# EAGLE schematic LoRa (EAGLE 8.6.1)

## Sheet 1 of 2: Power
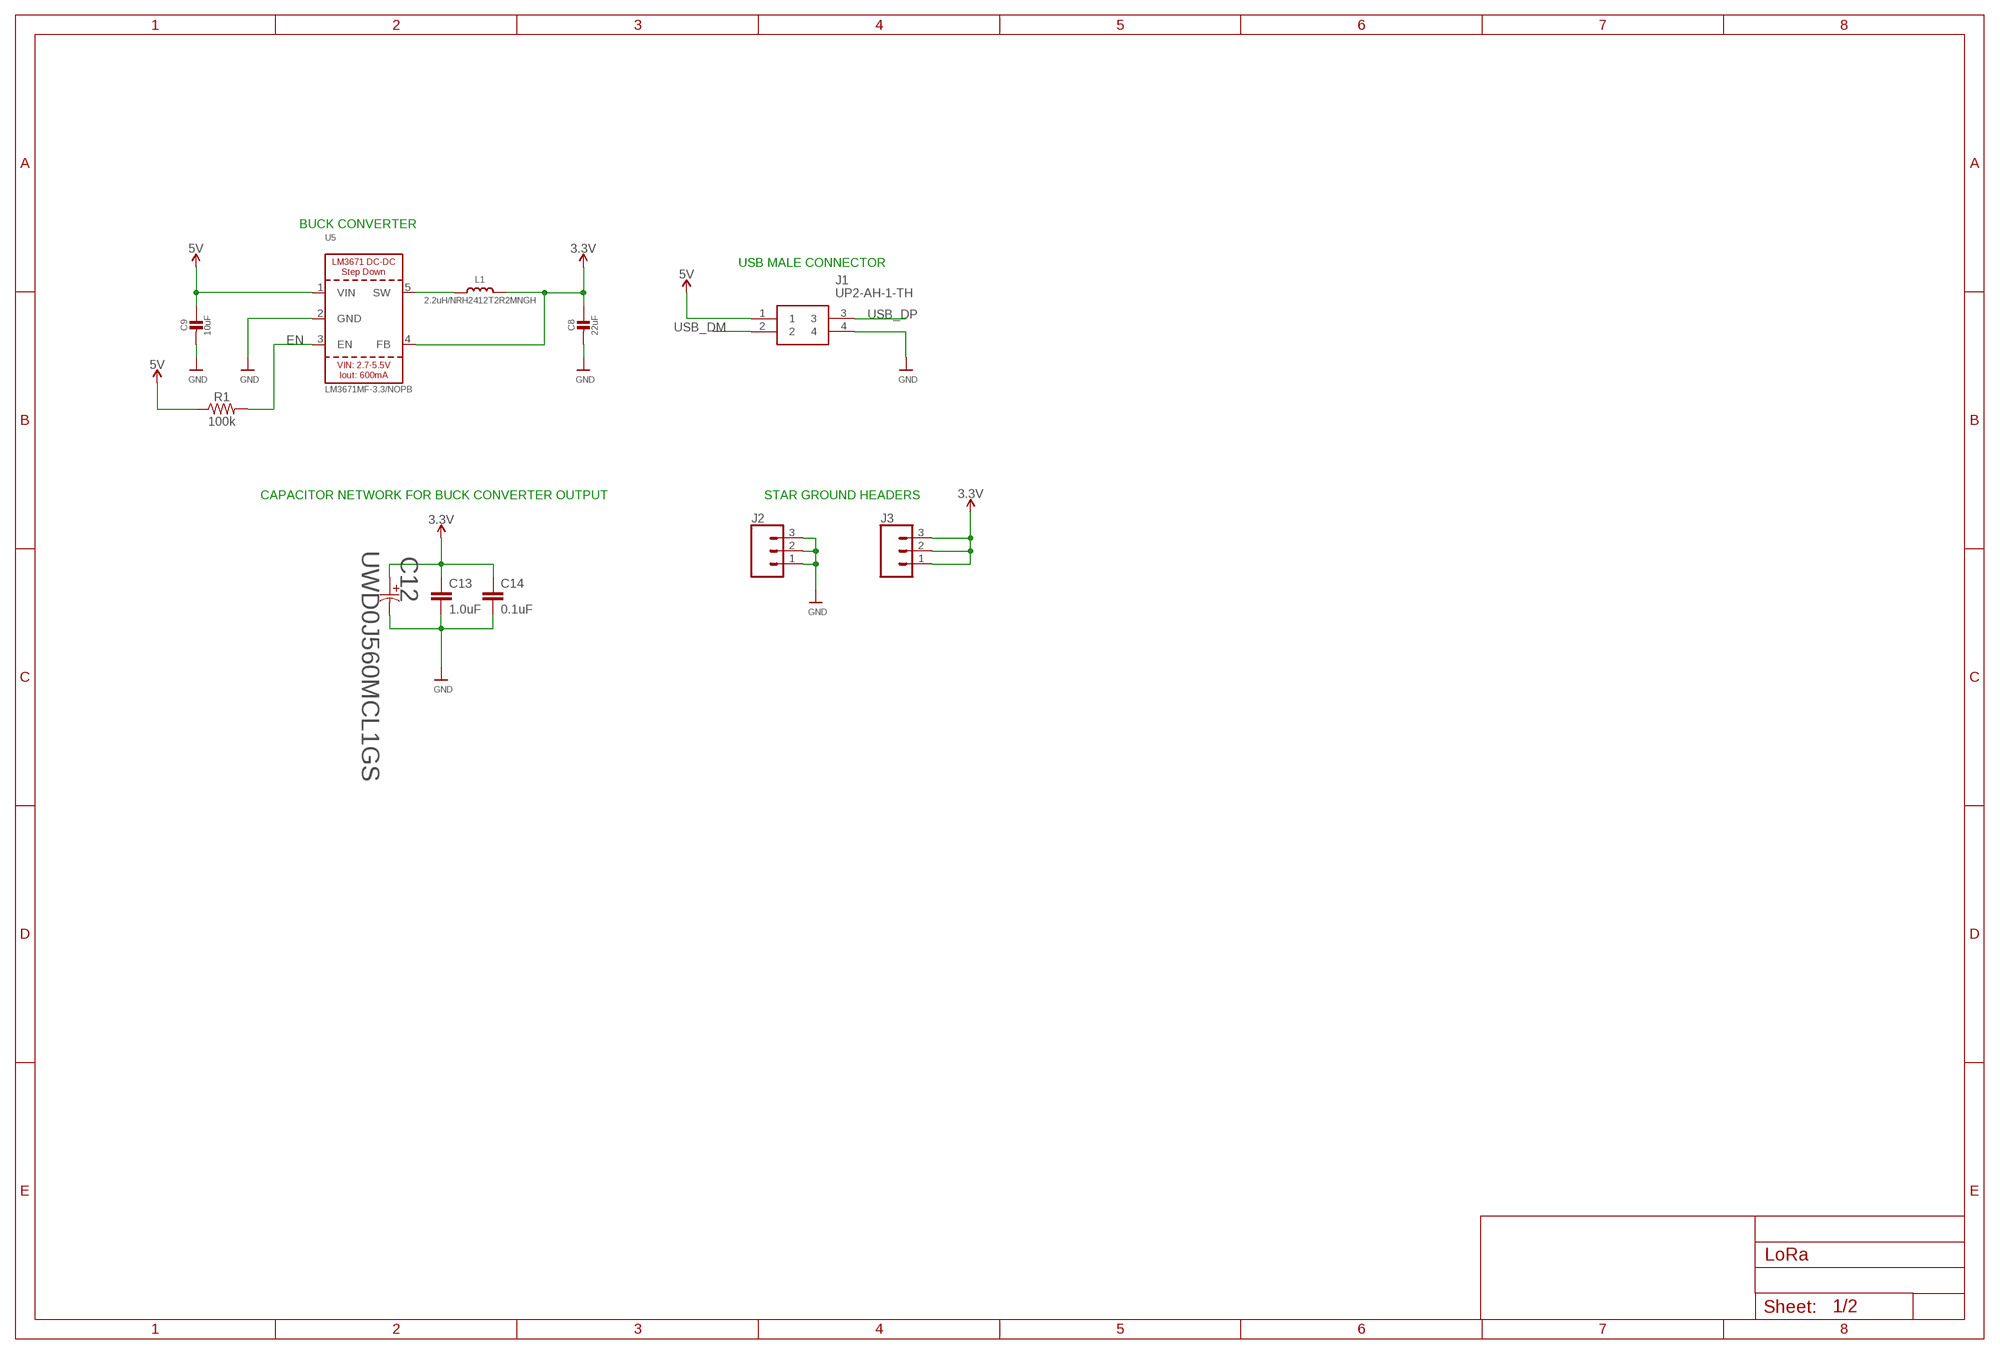
[diagram p0: schematic, sheet 1]

### Parts
C8  22uF  CAP_CERAMIC0805-NOOUTLINE  [0805-NO]
C9  10uF  CAP_CERAMIC0805-NOOUTLINE  [0805-NO]
C12  UWD0J560MCL1GS  [PCAP_5X5.8-ELECT]
C13  1.0uF  1.0UF-0603-16V-10%  [0603]
C14  0.1uF  0.1UF-0603-25V-(+80/-20%)  [0603]
J1  UP2-AH-1-TH  [UP2-AH-1-TH]
J2  CONN_03  [1X03]
J3  CONN_03  [1X03]
L1  2.2uH/NRH2412T2R2MNGH  INDUCTORNRH2412T  [INDUCTOR_TAIYOYUDEN_NRH2412T]
R1  100k  100KOHM-0603-1/10W-1%  [0603]
U5  LM3671MF-3.3/NOPB  VREG_LM3671  [SOT23-5]

### Nets
3.3V: C8.1 C12.1 C13.1 C14.1 J3.1 J3.2 J3.3 L1.2 U5.4(FB) ; also sheet 2
5V: C9.1 J1.1 R1.1 U5.1(VIN)
EN: R1.2 U5.3(EN)
GND: C8.2 C9.2 C12.2 C13.2 C14.2 J1.4 J2.1 J2.2 J2.3 U5.2(GND) ; also sheet 2
N$2: L1.1 U5.5(SW)
USB_DM: J1.2 ; also sheet 2
USB_DP: J1.3 ; also sheet 2

### Notes on the sheet
- BUCK CONVERTER
- USB MALE CONNECTOR
- CAPACITOR NETWORK FOR BUCK CONVERTER OUTPUT | STAR GROUND HEADERS

## Sheet 2 of 2: Microcontroller and LoRa
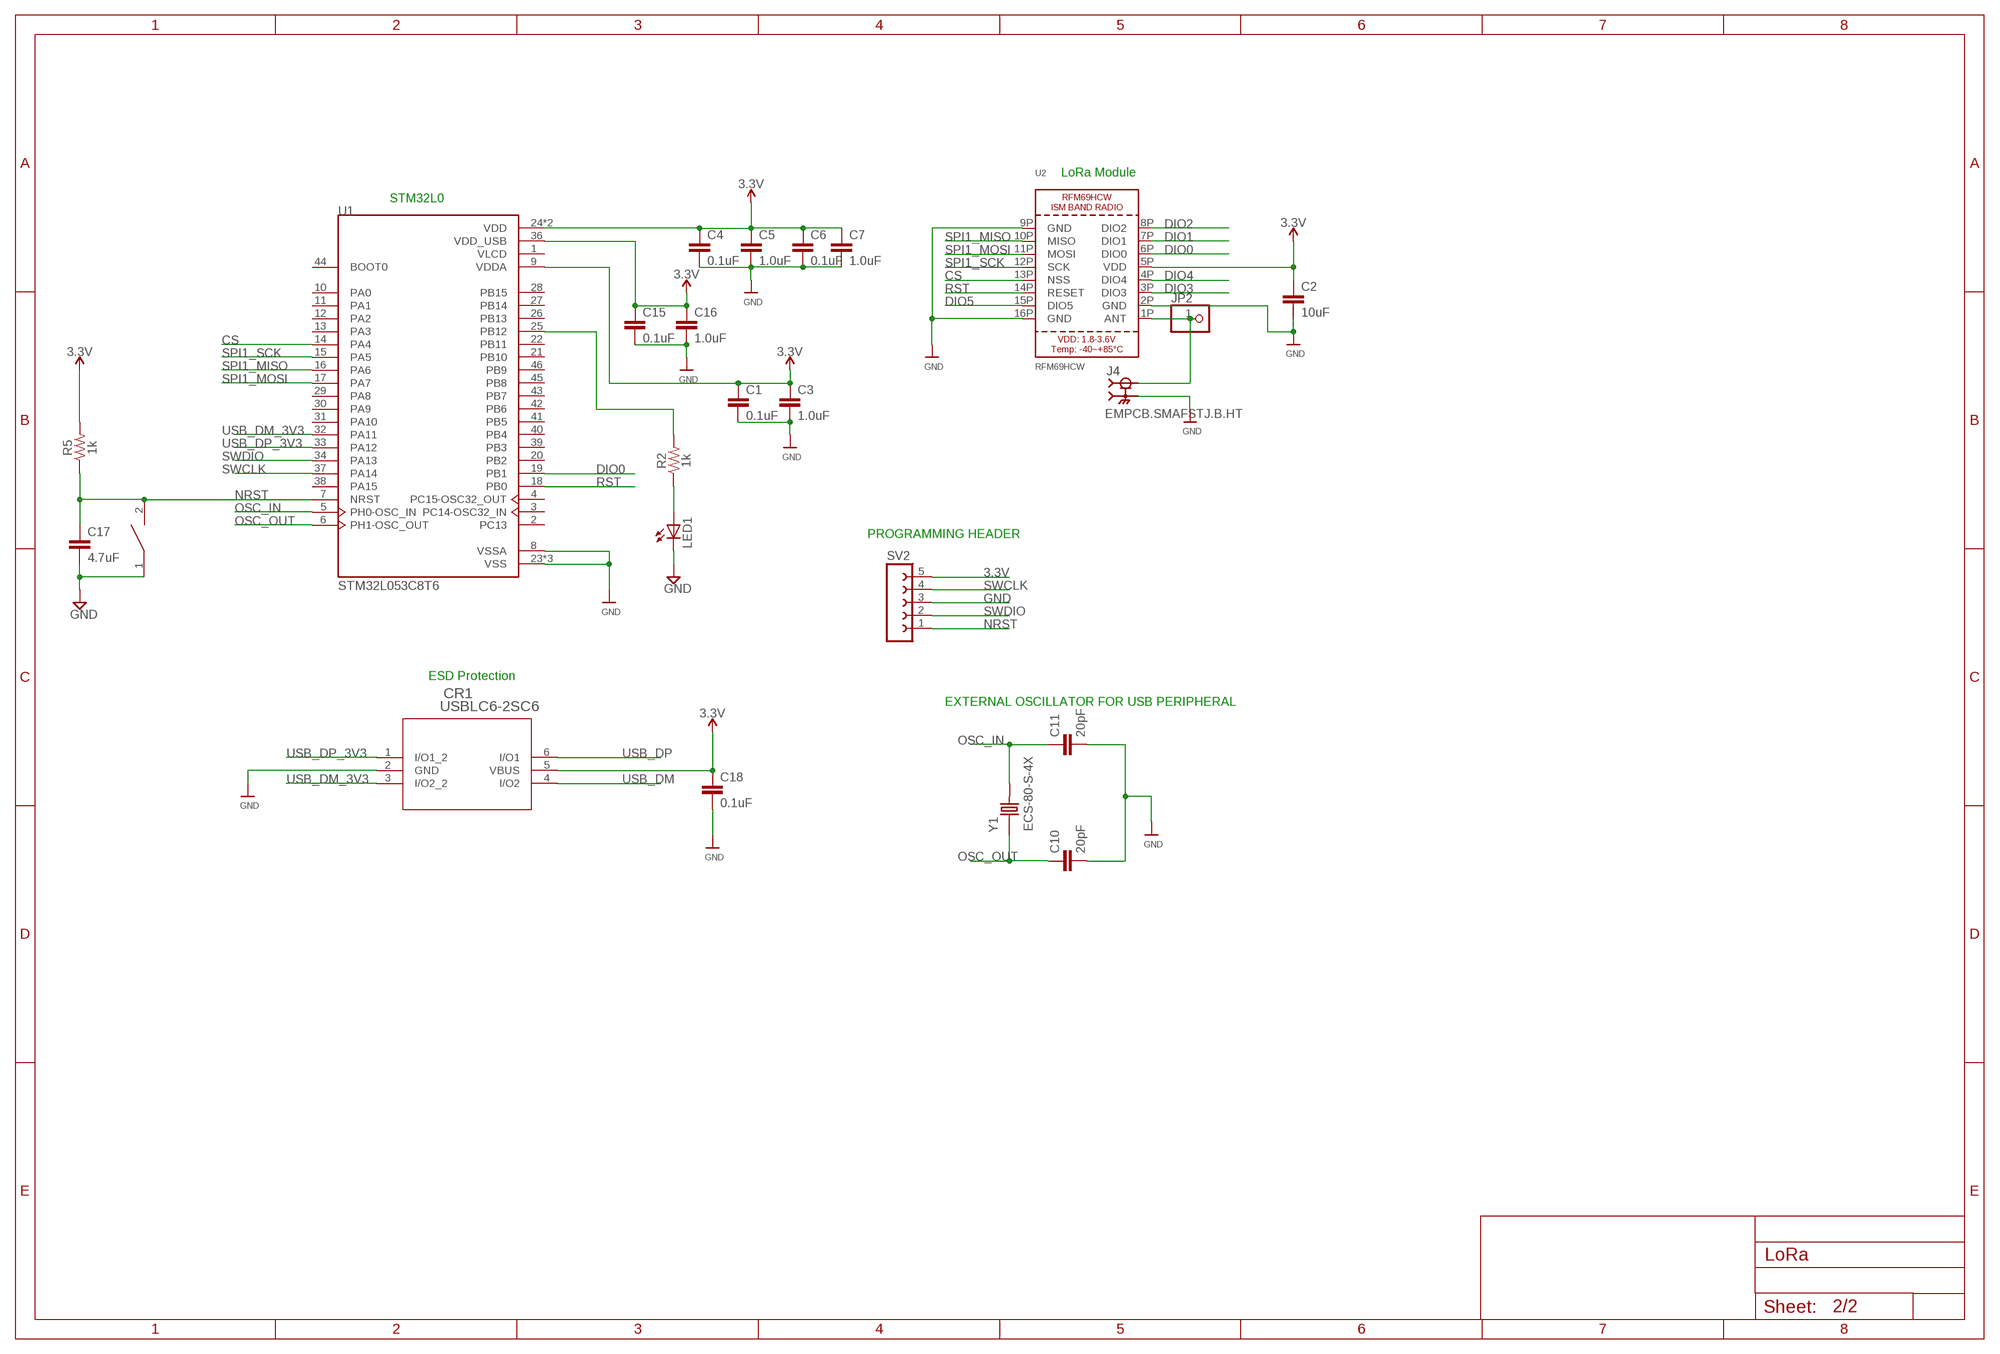
[diagram p1: schematic, sheet 2]

### Parts
C1  0.1uF  0.1UF-0603-25V-(+80/-20%)  [0603]
C2  10uF  10UF-0603-6.3V-20%  [0603]
C3  1.0uF  1.0UF-0603-16V-10%  [0603]
C4  0.1uF  0.1UF-0603-25V-(+80/-20%)  [0603]
C5  1.0uF  1.0UF-0603-16V-10%  [0603]
C6  0.1uF  0.1UF-0603-25V-(+80/-20%)  [0603]
C7  1.0uF  1.0UF-0603-16V-10%  [0603]
C10  20pF  4.7UF0603  [0603]
C11  20pF  4.7UF0603  [0603]
C15  0.1uF  0.1UF-0603-25V-(+80/-20%)  [0603]
C16  1.0uF  1.0UF-0603-16V-10%  [0603]
C17  4.7uF  4.7UF0603  [0603]
C18  0.1uF  0.1UF-0603-25V-(+80/-20%)  [0603]
CR1  USBLC6-2SC6  [SOT23-6L]
J4  EMPCB.SMAFSTJ.B.HT  [TAOGLAS_EMPCB.SMAFSTJ.B.HT]
JP2  HEADER-1X1ROUND  [1X01_ROUND]
LED1  LEDCHIP-LED0805  [CHIP-LED0805]
R2  1k  1KOHM-0603-1/10W-1%  [0603]
R5  1k  1KOHM-0603-1/10W-1%  [0603]
RESET  SWITCH  [SW_2512]
SV2  FE05-1  [FE05-1]
U1  STM32L053C8T6  [QFP50P900X900X160-48N]
U2  RFM69HCW  RFM69HCW_SMT  [RFMHCW_SMT]
Y1  ECS-80-S-4X  [XTAL_ECS-80-S-4X]

### Nets
3.3V: C1.1 C2.1 C3.1 C4.1 C5.1 C6.1 C7.1 C15.1 C16.1 C18.1 CR1.5(VBUS) R5.2 SV2.5 U1.9(VDDA) U1.24(VDD) U1.36(VDD_USB) U1.48(VDD) U2.5P(VDD) ; also sheet 1
CS: U1.14(PA4) U2.13P(NSS)
DIO0: U1.19(PB1) U2.6P(DIO0)
DIO1: U2.7P(DIO1)
DIO2: U2.8P(DIO2)
DIO3: U2.3P(DIO3)
DIO4: U2.4P(DIO4)
DIO5: U2.15P(DIO5)
GND: C1.2 C2.2 C3.2 C4.2 C5.2 C6.2 C7.2 C10.2 C11.2 C15.2 C16.2 C17.2 C18.2 CR1.2(GND) J4.SH1 J4.SH2 J4.SH3 J4.SH4 LED1.C RESET.1 SV2.3 U1.8(VSSA) U1.23(VSS) U1.35(VSS) U1.47(VSS) U2.2P(GND) U2.9P(GND) U2.16P(GND) ; also sheet 1
N$1: J4.1 JP2.1 U2.1P(ANT)
N$3: R2.2 U1.25(PB12)
N$4: LED1.A R2.1
NRST: C17.1 R5.1 RESET.2 SV2.1 U1.7(NRST)
OSC_IN: C11.1 U1.5(PH0-OSC_IN) Y1.2
OSC_OUT: C10.1 U1.6(PH1-OSC_OUT) Y1.1
RST: U1.18(PB0) U2.14P(RESET)
SPI1_MISO: U1.16(PA6) U2.10P(MISO)
SPI1_MOSI: U1.17(PA7) U2.11P(MOSI)
SPI1_SCK: U1.15(PA5) U2.12P(SCK)
SWCLK: SV2.4 U1.37(PA14)
SWDIO: SV2.2 U1.34(PA13)
USB_DM: CR1.4(I/O2) ; also sheet 1
USB_DM_3V3: CR1.3(I/O2_2) U1.32(PA11)
USB_DP: CR1.6(I/O1) ; also sheet 1
USB_DP_3V3: CR1.1(I/O1_2) U1.33(PA12)
Unconnected: U1.1(VLCD) U1.2(PC13) U1.3(PC14-OSC32_IN) U1.4(PC15-OSC32_OUT) U1.10(PA0) U1.11(PA1) U1.12(PA2) U1.13(PA3) U1.20(PB2) U1.21(PB10) U1.22(PB11) U1.26(PB13) U1.27(PB14) U1.28(PB15) U1.29(PA8) U1.30(PA9) U1.31(PA10) U1.38(PA15) U1.39(PB3) U1.40(PB4) U1.41(PB5) U1.42(PB6) U1.43(PB7) U1.44(BOOT0) U1.45(PB8) U1.46(PB9)

### Notes on the sheet
- LoRa Module
- STM32L0
- PROGRAMMING HEADER
- ESD Protection
- EXTERNAL OSCILLATOR FOR USB PERIPHERAL

## Library data of the parts
C1 C4 C6 C14 C15 C18 = SparkFun-Capacitors:0.1UF: 0.1µF ceramic capacitors A capacitor is a passive two-terminal electrical component used to store electrical energy temporarily in an electric field.; PROD_ID: CAP-00810
C2 = SparkFun-Capacitors:10UF: 10.0µF ceramic capacitors A capacitor is a passive two-terminal electrical component used to store electrical energy temporarily in an electric field.; PROD_ID: CAP-11015
C3 C5 C7 C13 C16 = SparkFun-Capacitors:1.0UF: 1µF ceramic capacitors A capacitor is a passive two-terminal electrical component used to store electrical energy temporarily in an electric field.; PROD_ID: CAP-00868
C8 C9 = microbuilder:CAP_CERAMIC: Ceramic Capacitors For new designs, use the packages preceded by an '_' character since they are more reliable: The following footprints should be used on most boards: _0402 - Standard footprint for regular board layouts _0603 - Standard footprint for regular board layouts _0805 - Standard footprint for regular board layouts _1206 - Standard footprint for regular board layouts For extremely tight-pitch boards where space is at a premium, the following 'micro-pitch' footprints can be used (smaller pads, no silkscreen outline, etc.): _0402MP - Micro-pitch footprint for very dense/compact boards _0603MP - Micro-pitch footprint for very dense/compact boards _0805MP - Micro-pitch footprint for very dense/compact boards _1206MP - Micro-pitch footprint for very dense/compact boards
C10 C11 = SparkFun-Capacitors:4.7UF: 4.7µF ceramic capacitors A capacitor is a passive two-terminal electrical component used to store electrical energy temporarily in an electric field.; PROD_ID: CAP-08280; VALUE: 4.7uF
C12 = 56uF_Cap_6.3v:UWD0J560MCL1GS; BUILT_BY: EMA_UL_Team; MANUFACTURER_PART_NUMBER: UWD0J560MCL1GS; VENDOR: Nichicon
C17 = SparkFun-Capacitors:4.7UF: 4.7µF ceramic capacitors A capacitor is a passive two-terminal electrical component used to store electrical energy temporarily in an electric field.; PROD_ID: CAP-08280
CR1 = ESD_Protection:USBLC6-2SC6; BUILT_BY: EMA_UL_Team; MANUFACTURER_PART_NUMBER: USBLC6-2SC6; VENDOR: STMicroelectronics
J1 = USB_Con:UP2-AH-1-TH: USB Connectors USB 2.0 type A plug 4 pin Horizontal TH Source: Datasheet <http://www.cui.com/product/resource/up2-ah-th.pdf>; DESCRIPTION: USB Connectors USB 2.0 type A plug 4 pin Horizontal TH; HEIGHT: mm; MANUFACTURER_NAME: CUI; MANUFACTURER_PART_NUMBER: UP2-AH-1-TH; MOUSER_PART_NUMBER: 490-UP2-AH-1-TH; MOUSER_PRICE-STOCK: https://www.mouser.com/Search/Refine.aspx?Keyword=490-UP2-AH-1-TH
J2 J3 = SparkFun-Connectors:CONN_03: Multi connection point. Often used as Generic Header-pin footprint for 0.1 inch spaced/style header connections On any of the 0.1 inch spaced packages, you can populate with these: Break Away Headers - Straight <https://www.sparkfun.com/products/116> (PRT-00116) Break Away Male Headers - Right Angle <https://www.sparkfun.com/products/553> (PRT-00553) Female Headers <https://www.sparkfun.com/products/115> (PRT-00115) Break Away Headers - Machine Pin <https://www.sparkfun.com/products/117> (PRT-00117) Break Away Female Headers - Swiss Machine Pin <https://www.sparkfun.com/products/743> (PRT-00743) Stackable Header - 3 Pin (Female, 0.1") <https://www.sparkfun.com/products/13875> (PRT-13875) For SCREWTERMINALS and SPRING TERMINALS visit here: Screw Terimnals on SparkFun.com <https://www.sparkfun.com/search/results?term=Screw+Terminals> (5mm/3.5mm/2.54mm spacing) This device is also useful as a general connection point to wire up your design to another part of your project. Our various solder wires solder well into these plated through hole pads. Hook-Up Wire - Assortment (Stranded, 22 AWG) <https://www.sparkfun.com/products/11375> (PRT-11375) Hook-Up Wire - Assortment (Solid Core, 22 AWG) <https://www.sparkfun.com/products/11367> (PRT-11367) View the entire wire category on our website here <https://www.sparkfun.com/categories/141> Special notes: Molex polarized connector foot print use with SKU : PRT-08232 with associated crimp pins and housings.
J4 = EMPCB.SMAFSTJ.B.HT:EMPCB.SMAFSTJ.B.HT: Conn SMA F 0Hz to 12.4GHz 50Ohm Solder ST Edge Mount Gold; DESCRIPTION: SMA Connector Jack, Female Socket 50Ohm Board Edge, End Launch Solder; DIGI-KEY_PART_NUMBER: 931-1175-ND; DIGI-KEY_PURCHASE_URL: https://www.digikey.com/product-detail/en/taoglas-limited/EMPCB.SMAFSTJ.B.HT/931-1175-ND/3522337?utm_source=snapeda&utm_medium=aggregator&utm_campaign=symbol; MF: Taoglas Limited; MP: EMPCB.SMAFSTJ.B.HT; PACKAGE: None
JP2 = microbuilder:HEADER-1X1: PIN HEADER
L1 = microbuilder:INDUCTOR: Inductors 0603: 10nH Ceramic Inductor - microwire antenna/RF (Digikey: 712-1434-2-ND) 0805: 560nH Ceramic Inductor - RF (Digikey: 553-1047-1-ND) 270nH Ceramic Inductor - Q = 40@250MHz, +-5%, 1 Ohm DC Resistance (Digikey: 535-10506-2-ND) 1007 (2518 Metric) SMT: 10µH 10% 250mOhm 820mA 1007 Inductor (Digikey: 587-2189-1-ND) 22µH 10% 500mOhm 580mA 1007 Inductor (Digikey: 587-2190-1-ND) 47µH 10% 950mOhm 420mA 1007 Inductor (Digikey: 587-2191-1-ND) 47µH 5% 100mOhm 1A 1008 Inductor (Digikey: 732-1816-1-ND) 5.0x5.0mm (Taiyo Yuden NR5040 Series) 6.8µH 20% 2.3A 64mOhm Inductor (Digikey: 587-2374-2-ND) 5.0x5.0mm (TDK VLC5045 Series) 4.7µH 20% 3.3A 34mOhm Inductor (Digikey: 445-6526-1-ND) 6.8µH 20% 2.7A 46mOhm Inductor (Digikey: 445-6527-1-ND) 6.0x6.0mm (TDK VLC6045 Series) 4.7µH 20% 3.8A 27mOhm Inductor (Digikey: 445-6538-2-ND) 6.8µH 20% 3A 41mOhm Inductor (Digikey: 445-6540-1-ND) 6.2µH 30% 2.2A 45mOhm Inductor (Digikey: SRR5028-6R2YCT-ND) - Not TDK VLC6045 but footprint should match 6.0x6.0mm (TDK SLF6045 Series) 6.8uH 30% 2A 33mOhm Inductor (Digikey: 445-4572-1-ND, Mouser: 810-SLF645T6R8N2R0PF) 6.0x6.0mm (Sumida CDRH5D28 Series) 6.2uH 30% 1.8A 45mOhm Inductor (Digikey: 308-1542-1-ND) Taiyo Yuden NR3015T2R2M - 2.2uH 20% 1.5A (Digikey: 587-1648-2-ND, Mouser: 963-NR3015T2R2M) - Used with TI TPS62172 CoilCraft RFID Transponder Coil - MA5532-AE (For use with AS3935 Lightning Sensor) Taiyo Yuden NRH2412T2R2MNGH - 2.2uH 20% 1AA (Digikey: 587-3443-1-ND) - Used with TI LM3671 Vishay IHLP 1.0uH Molded Inductor - 24mOhm DCR, 5A, +/-20%, -55°C-125°C (Digikey: 541-1319-1-ND)
LED1 = led:LED: LED OSRAM: - CHIPLED LG R971, LG N971, LY N971, LG Q971, LY Q971, LO R971, LY R971 LH N974, LH R974 LS Q976, LO Q976, LY Q976 LO Q996 - Hyper CHIPLED LW Q18S LB Q993, LB Q99A, LB R99A - SideLED LS A670, LO A670, LY A670, LG A670, LP A670 LB A673, LV A673, LT A673, LW A673 LH A674 LY A675 LS A676, LA A676, LO A676, LY A676, LW A676 LS A679, LY A679, LG A679 - Hyper Micro SIDELED® LS Y876, LA Y876, LO Y876, LY Y876 LT Y87S - SmartLED LW L88C, LW L88S LB L89C, LB L89S, LG L890 LS L89K, LO L89K, LY L89K LS L896, LA L896, LO L896, LY L896 - TOPLED LS T670, LO T670, LY T670, LG T670, LP T670 LSG T670, LSP T670, LSY T670, LOP T670, LYG T670 LG T671, LOG T671, LSG T671 LB T673, LV T673, LT T673, LW T673 LH T674 LS T676, LA T676, LO T676, LY T676, LB T676, LH T676, LSB T676, LW T676 LB T67C, LV T67C, LT T67C, LS T67K, LO T67K, LY T67K, LW E67C LS E67B, LA E67B, LO E67B, LY E67B, LB E67C, LV E67C, LT E67C LW T67C LS T679, LY T679, LG T679 LS T770, LO T770, LY T770, LG T770, LP T770 LB T773, LV T773, LT T773, LW T773 LH T774 LS E675, LA E675, LY E675, LS T675 LS T776, LA T776, LO T776, LY T776, LB T776 LHGB T686 LT T68C, LB T68C - Hyper Mini TOPLED® LB M676 - Mini TOPLED Santana® LG M470 LS M47K, LO M47K, LY M47K Source: http://www.osram.convergy.de LUXEON: - LUMILED® LXK2-PW12-R00, LXK2-PW12-S00, LXK2-PW14-U00, LXK2-PW14-V00 LXK2-PM12-R00, LXK2-PM12-S00, LXK2-PM14-U00 LXK2-PE12-Q00, LXK2-PE12-R00, LXK2-PE12-S00, LXK2-PE14-T00, LXK2-PE14-U00 LXK2-PB12-K00, LXK2-PB12-L00, LXK2-PB12-M00, LXK2-PB14-N00, LXK2-PB14-P00, LXK2-PB14-Q00 LXK2-PR12-L00, LXK2-PR12-M00, LXK2-PR14-Q00, LXK2-PR14-R00 LXK2-PD12-Q00, LXK2-PD12-R00, LXK2-PD12-S00 LXK2-PH12-R00, LXK2-PH12-S00 LXK2-PL12-P00, LXK2-PL12-Q00, LXK2-PL12-R00 Source: www.luxeon.com KINGBRIGHT: KA-3528ASYC Source: www.kingbright.com; SPICEPREFIX: L
R1 = SparkFun-Resistors:100KOHM: 100kΩ resistor A resistor is a passive two-terminal electrical component that implements electrical resistance as a circuit element. Resistors act to reduce current flow, and, at the same time, act to lower voltage levels within circuits. - Wikipedia; PROD_ID: RES-07828
R2 R5 = SparkFun-Resistors:1KOHM: 1kΩ resistor A resistor is a passive two-terminal electrical component that implements electrical resistance as a circuit element. Resistors act to reduce current flow, and, at the same time, act to lower voltage levels within circuits. - Wikipedia; PROD_ID: RES-07856
RESET = DiscreteComponents:SWITCH
SV2 = con-lsta:FE05-1: FEMALE HEADER; OC_FARNELL: unknown; OC_NEWARK: unknown
U1 = STM32L053C8T6:STM32L053C8T6: Ultra-low-power ARM Cortex-M0+ MCU with 64 Kbytes Flash, 32 MHz CPU, USB, LCD; DESCRIPTION: ARM® Cortex®-M0+ STM32L0 Microcontroller IC 32-Bit 32MHz 64KB _64K x 8_ FLASH 48-LQFP _7x7_; DIGI-KEY_PART_NUMBER: 497-14906-ND; DIGI-KEY_PURCHASE_URL: https://www.digikey.com/product-detail/en/stmicroelectronics/STM32L053C8T6/497-14906-ND/4935255?utm_source=snapeda&utm_medium=aggregator&utm_campaign=symbol; MF: STMicroelectronics; MP: STM32L053C8T6; PACKAGE: LQFP-48 STMicroelectronics
U2 = microbuilder:RFM69HCW: RFM69HCW - ISM Band RF Transceiver
U5 = microbuilder:VREG_LM3671: LM3671 - 600mA DC-DC Step-Down Converter VIN: 2.7-5.5V Load Current: 600mA Switching Frequency: 2MHz Iq: 16uA
Y1 = ECS-80-S-4X:ECS-80-S-4X: CRYSTAL T/H; DESCRIPTION: Crystal 8MHz Series 2-Pin HC-49/U; DIGI-KEY_PART_NUMBER: X1057-ND; DIGI-KEY_PURCHASE_URL: https://www.digikey.com/product-detail/en/ecs-inc/ECS-80-S-4X/X1057-ND/827549?utm_source=snapeda&utm_medium=aggregator&utm_campaign=symbol; MF: ECS International; MP: ECS-80-S-4X; PACKAGE: HC-49/US ECS International